# EAGLE design pcb_5 (EAGLE 5.06)
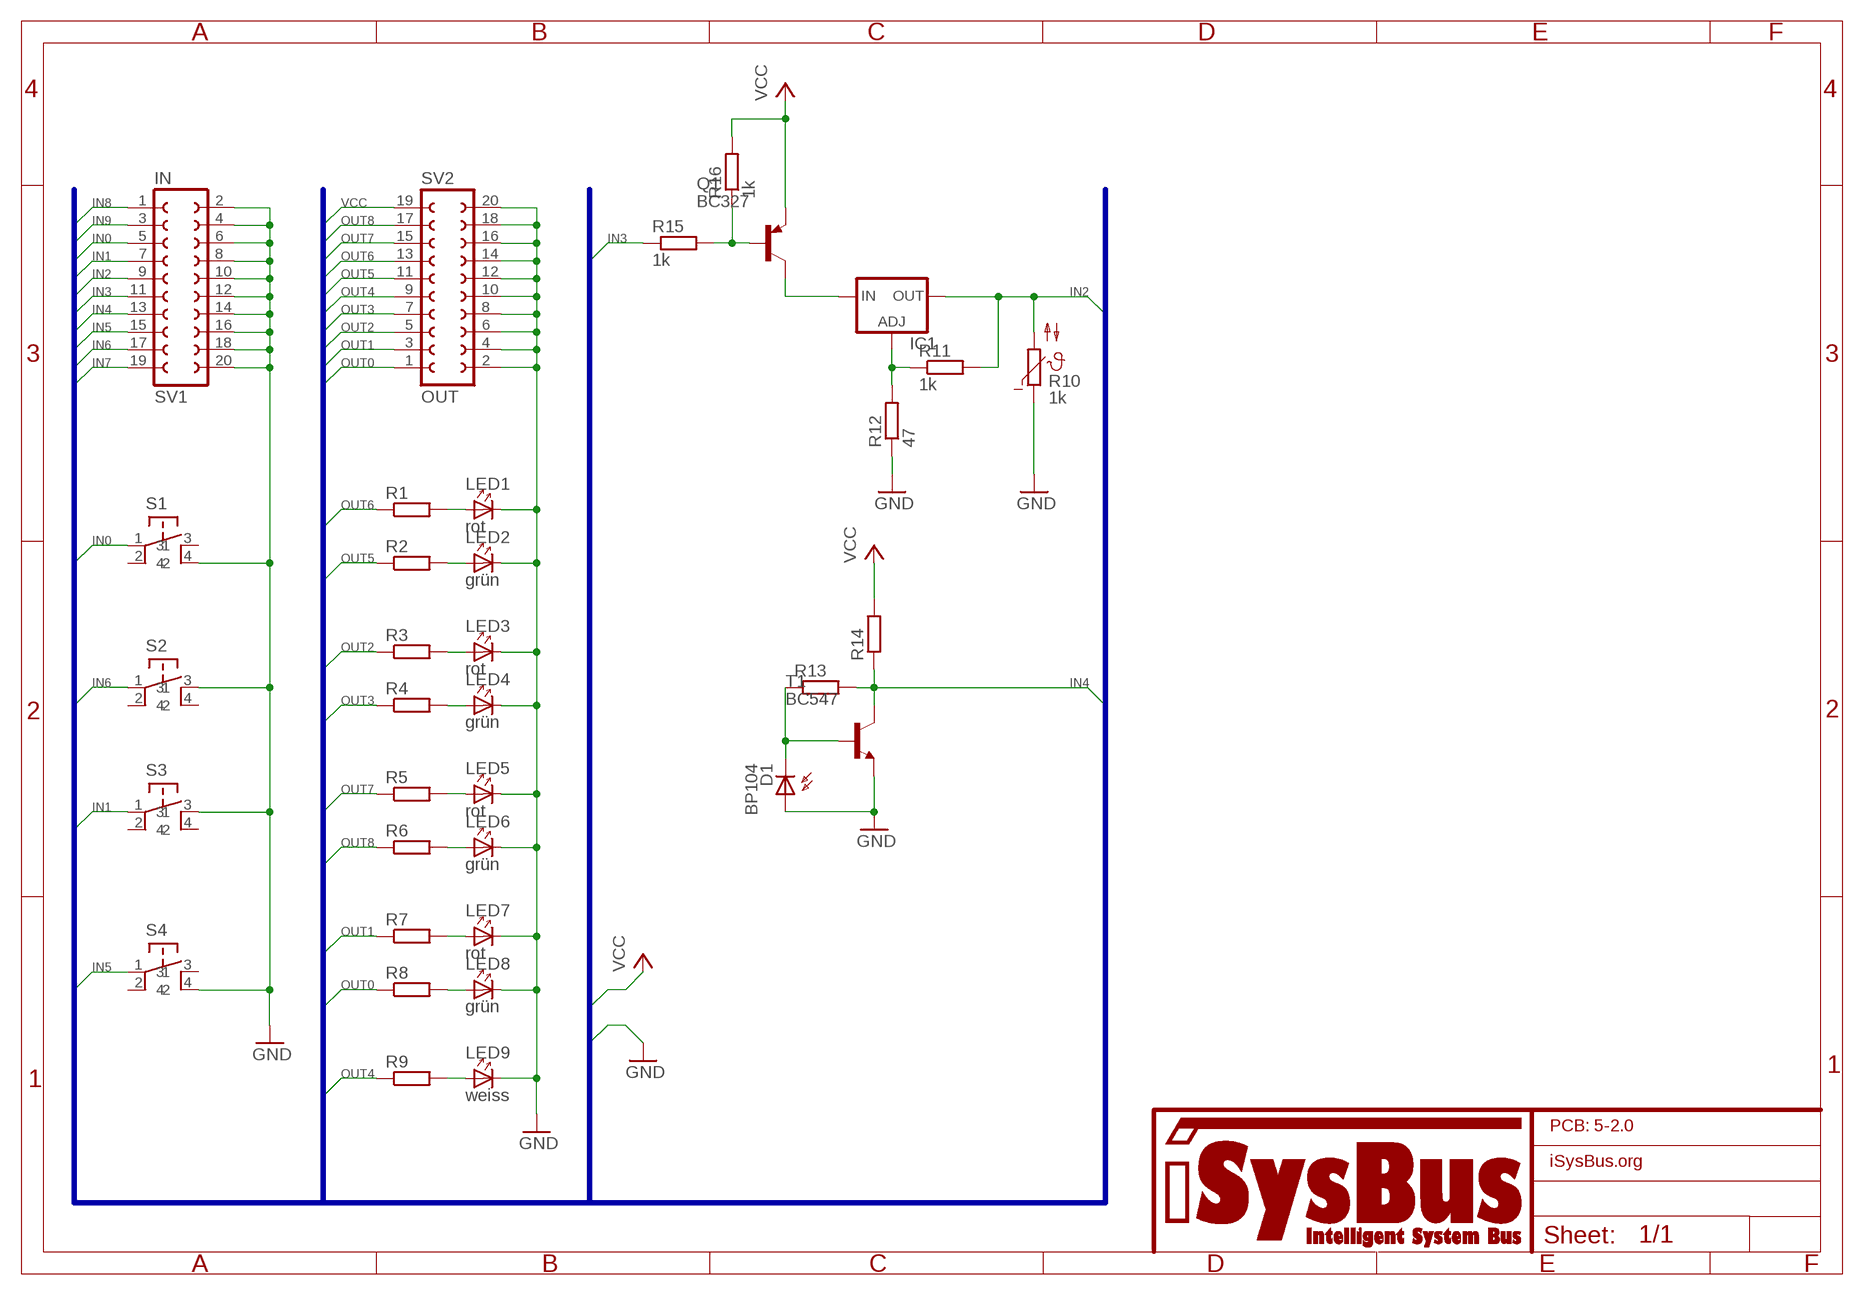
[diagram p0: schematic, sheet 1]

## Parts
D1  BP104  [BP104]
IC1  LM317L  [317L]
LED1  rot  LED_PLCC2-PLCC3528  [PLCC2-PLCC3528]
LED2  grün  LED_PLCC2-PLCC3528  [PLCC2-PLCC3528]
LED3  rot  LED_PLCC2-PLCC3528  [PLCC2-PLCC3528]
LED4  grün  LED_PLCC2-PLCC3528  [PLCC2-PLCC3528]
LED5  rot  LED_PLCC2-PLCC3528  [PLCC2-PLCC3528]
LED6  grün  LED_PLCC2-PLCC3528  [PLCC2-PLCC3528]
LED7  rot  LED_PLCC2-PLCC3528  [PLCC2-PLCC3528]
LED8  grün  LED_PLCC2-PLCC3528  [PLCC2-PLCC3528]
LED9  weiss  LED_PLCC2-PLCC3528  [PLCC2-PLCC3528]
Q1  BC327  [TO92]
R1  R-R0805  [R0805]
R2  R-R0805  [R0805]
R3  R-R0805  [R0805]
R4  R-R0805  [R0805]
R5  R-R0805  [R0805]
R6  R-R0805  [R0805]
R7  R-R0805  [R0805]
R8  R-R0805  [R0805]
R9  R-R0805  [R0805]
R10  1k  NTC640  [P640]
R11  1k  R-R0805  [R0805]
R12  47  R-R0805  [R0805]
R13  R-R0805  [R0805]
R14  R-R0805  [R0805]
R15  1k  R-R0805  [R0805]
R16  1k  R-R0805  [R0805]
S1  LSH1301  [LSH1301]
S2  LSH1301  [LSH1301]
S3  LSH1301  [LSH1301]
S4  LSH1301  [LSH1301]
SV1  IN  FE10-2  [FE10-2]
SV2  OUT  FE10-2  [FE10-2]
T1  BC547  [TO92]
U$1  FIELD_ISB  [FIELD_ISB]
U$2  5-2.0  FIELD_PCB  [FIELD_PCB]
U$3  ISYSBUS_LOGO  [ISYSBUS_LOGO]

## Nets
GND: D1.A LED1.C LED2.C LED3.C LED4.C LED5.C LED6.C LED7.C LED8.C LED9.C R10.1 R12.1 S1.4 S2.3 S3.3 S4.4 SV1.2 SV1.4 SV1.6 SV1.8 SV1.10 SV1.12 SV1.14 SV1.16 SV1.18 SV1.20 SV2.2 SV2.4 SV2.6 SV2.8 SV2.10 SV2.12 SV2.14 SV2.16 SV2.18 SV2.20 T1.1(E)
IN0: S1.1 SV1.5
IN1: S3.1 SV1.7
IN2: IC1.2(OUT) R10.2 R11.2 SV1.9
IN3: R15.1 SV1.11
IN4: R13.2 R14.1 SV1.13 T1.3(C)
IN5: S4.1 SV1.15
IN6: S2.1 SV1.17
IN7: SV1.19
IN8: SV1.1
IN9: SV1.3
N$1: D1.K(C) R13.1 T1.2(B)
N$2: LED1.A R1.2
N$3: LED2.A R2.2
N$4: LED3.A R3.2
N$5: LED4.A R4.2
N$6: LED5.A R5.2
N$7: LED6.A R6.2
N$8: LED7.A R7.2
N$9: LED8.A R8.2
N$10: LED9.A R9.2
N$11: IC1.1(ADJ) R11.1 R12.2
N$12: Q1.2(B) R15.2 R16.1
N$13: IC1.3(IN) Q1.3(C)
OUT0: R8.1 SV2.1
OUT1: R7.1 SV2.3
OUT2: R3.1 SV2.5
OUT3: R4.1 SV2.7
OUT4: R9.1 SV2.9
OUT5: R2.1 SV2.11
OUT6: R1.1 SV2.13
OUT7: R5.1 SV2.15
OUT8: R6.1 SV2.17
VCC: Q1.1(E) R14.2 R16.2 SV2.19
Unconnected: S1.2 S1.3 S2.2 S2.4 S3.2 S3.4 S4.2 S4.3

## Buses
IN[0..9],VCC,GND
OUT[0..8],VCC,GND

## Library data of the parts
D1 = opto-trans-siemens:BP104: PHOTO DIODE
IC1 = v-reg:LM317L: VOLTAGE REGULATOR
LED1-LED9 = isysbus_active:LED_PLCC2-PLCC3528
Q1 = transistor-pnp:BC327: PNP Transistor
R1-R9 R11-R16 = isb_resistors:R: RESISTOR, European symbol
R10 = ptc-ntc:NTC640: PHILIPS NTC
S1-S4 = isb_buttons:LSH1301
SV1 SV2 = con-lsta:FE10-2: FEMALE HEADER
T1 = transistor:BC547: NPN TRANSISTOR
U$1 = isb_misc:FIELD_ISB
U$2 = isb_misc:FIELD_PCB
U$3 = isysbus_misc:ISYSBUS_LOGO: iSysBus Logo

## Board
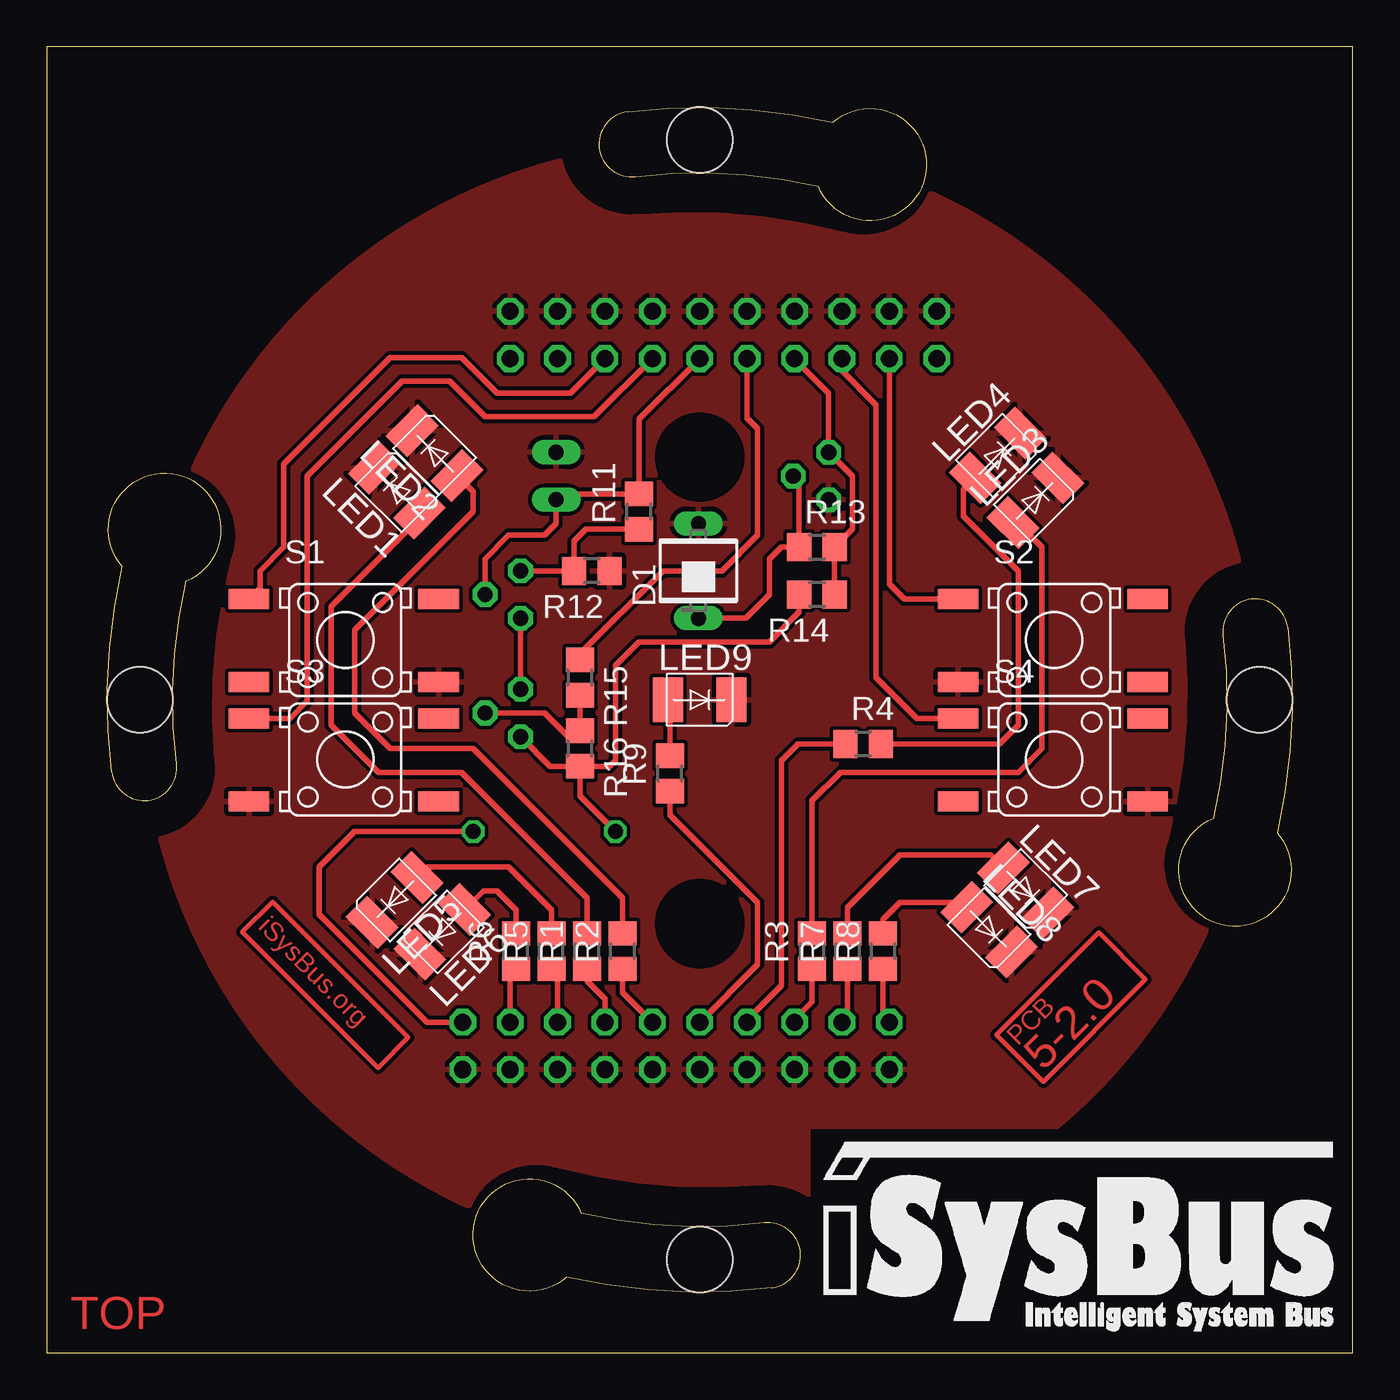
[diagram p1: board, top side]
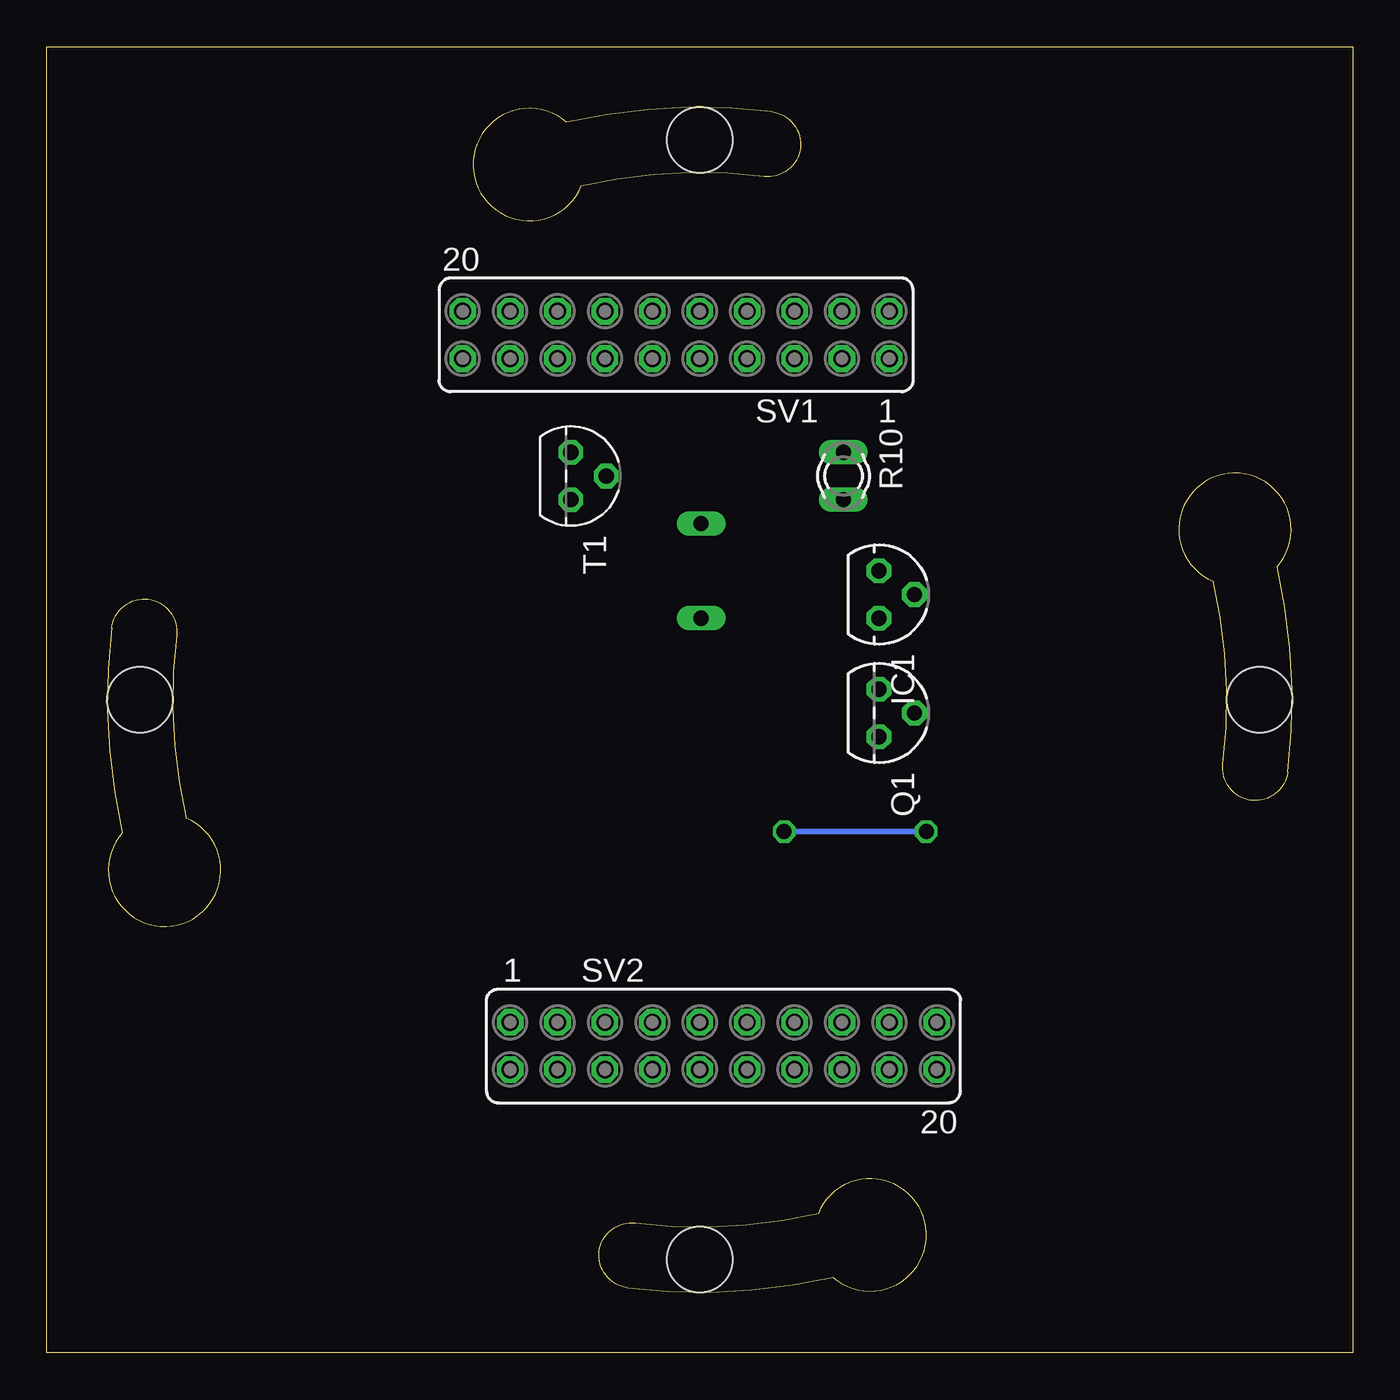
[diagram p2: board, bottom side, seen from below]

Size 70 x 70 mm. Coordinates in mm from the lower left corner, seen from the top.
Outline: 0,0 70,0 70,70 0,70 0,0
Copper layers (1*16): Top 0.035mm / dielectric 1.5mm / Bottom 0.035mm
Design rules "default": minimum track width 10mil, minimum drill 24mil, track to track 8mil, track to pad 8mil, pad to pad 8mil, via to via 8mil, smd to smd 8mil, copper to edge 40mil, drill to drill 8mil, minimum pad ring 10mil, minimum via ring 8mil, stop-mask expansion 4mil, vias tented up to drill 0mil, thermal gap 10mil
Holes 3.5 mm at 35,5 35,65 5,35 65,35
tRestrict: area 32.8,20.8 to 37.2,25.2; area 32.8,45.8 to 37.2,50.2; area 5,5 to 65,65; 16 lines
Milling: 16 lines

### Footprints (pad centres in the part's own frame; a part is rotated, then mirrored left to right if it is on the bottom)
BP104 = drill 0.813 long: A 0,2.54; K 0,-2.54
317L = drill 0.813 octagon: 1 -1.27,0; 2 0,1.905; 3 1.27,0
PLCC2-PLCC3528 = smd 1.6 x 2.4: A -1.7,0; C 1.7,0
TO92 = drill 0.813 octagon: 1 1.27,0; 2 0,1.905; 3 -1.27,0
R0805 = smd 1.3 x 1.5: 1 -0.95,0; 2 0.95,0
P640 = drill 0.813 long: 1 -1.27,0; 2 1.27,0
LSH1301 = smd 2.184 x 1.067: 1 -5.155,2.195; 2 5.005,2.195; 3 -5.155,-2.25; 4 5.005,-2.25
FE10-2 = drill 0.914 octagon: 1 -11.43,1.27; 2 -11.43,-1.27; 3 -8.89,1.27; 4 -8.89,-1.27; 5 -6.35,1.27; 6 -6.35,-1.27; 7 -3.81,1.27; 8 -3.81,-1.27; 9 -1.27,1.27; 10 -1.27,-1.27; 11 1.27,1.27; 12 1.27,-1.27; 13 3.81,1.27; 14 3.81,-1.27; 15 6.35,1.27; 16 6.35,-1.27; 17 8.89,1.27; 18 8.89,-1.27; 19 11.43,1.27; 20 11.43,-1.27

### Placement (x,y rotation side)
D1  34.92,41.91 0 top
IC1  25.4,40.64 270 bottom
LED1  18.77,46.21 135 top
LED2  20.79,48.22 135 top
LED3  52.98,45.7 45 top
LED4  50.97,48.09 45 top
LED5  18.65,24.27 225 top
LED6  21.2,22.56 225 top
LED7  52.47,24.79 315 top
LED8  50.5,22.68 315 top
LED9  35,35 0 top
Q1  25.4,34.29 270 bottom
R1  28.95,21.53 90 top
R2  30.86,21.53 90 top
R3  41.02,21.53 90 top
R4  43.76,32.64 0 top
R5  27.05,21.53 90 top
R6  25.14,21.53 90 top
R7  42.92,21.53 90 top
R8  44.83,21.53 90 top
R9  33.4,31.05 90 top
R10  27.3,46.99 270 bottom
R11  31.75,45.09 90 top
R12  29.21,41.91 180 top
R13  41.27,43.18 0 top
R14  41.27,40.64 180 top
R15  28.57,36.2 270 top
R16  28.57,32.38 270 top
S1  16,38.2 0 top
S2  54,38.2 0 top
S3  16,31.8 0 top
S4  54,31.8 0 top
SV1  36.27,54.55 180 bottom
SV2  33.73,16.45 0 bottom
T1  41.91,46.99 270 bottom
U$1  10.13,21.66 315 top
U$2  53.41,15.07 45 top
U$3  41.61,1.17 0 top

### Tracks (layer width: path | path; a pad name or v marks a point on that pad's centre or on a via)
GND
  pour Top: 1.27,68.58 68.58,68.58 68.58,1.27 1.27,1.27
IN0
  Top 0.305: SV1.5 28.07,51.44 24.13,51.44 22.23,53.34 18.41,53.34 12.7,47.62 12.7,43.18 11.43,41.91 11.43,40.98 S1.1
IN1
  Top 0.305: SV1.7 29.34,50.16 23.5,50.16 21.59,52.07 19.05,52.07 13.97,46.99 13.97,34.92 13.04,33.99 S3.1
IN2
  Top 0.305: IC1.2 23.5,42.55 24.77,43.81 26.67,43.81 27.3,44.45 R10.2 27.62,46.03 R11.2 31.75,50.03 SV1.9
IN3
  Top 0.305: SV1.11 37.54,50.09 38.1,49.53 38.1,48.26 38.1,46.99 38.1,43.81 36.2,41.91 33.02,41.91 28.57,37.47 R15.1
IN4
  Top 0.305: SV1.13 40.08,53.27 41.91,51.44 T1.3 43.18,46.99 43.18,44.13 R13.2 R14.1
IN5
  Top 0.305: SV1.15 42.62,52.63 44.45,50.8 44.45,36.2 46.65,33.99 S4.1
IN6
  Top 0.305: S2.1 45.97,40.4 45.16,41.2 SV1.17
N$1
  Top 0.305: D1.K 37.47,39.37 38.73,40.64 38.73,42.55 39.37,43.18 R13.1 40.33,46.67 T1.2
N$2
  Top 0.305: R1.2 28.95,24.39 22.23,31.11 17.78,31.11 15.24,33.66 15.24,40.01 19.68,44.45 19.68,44.72 LED1.A
N$3
  Top 0.305: LED2.A 22.86,46.15 22.86,45.09 16.51,38.73 16.51,34.29 18.41,32.38 22.86,32.38 30.86,24.39 R2.2
N$4
  Top 0.305: LED3.A 52.03,44.49 53.34,43.18 53.34,32.38 52.07,31.11 47.62,31.11 | 47.62,31.11 46.35,31.11 | R3.2 41.02,29.59 42.55,31.11 47.62,31.11
N$5
  Top 0.305: R4.2 51.05,32.64 52.07,33.66 52.07,41.91 49.13,44.85 49.13,46.26 LED4.A
N$6
  Top 0.305: R5.2 27.05,23.75 24.77,26.04 20.41,26.04 LED5.A
N$7
  Top 0.305: R6.2 25.14,23.75 24.13,24.77 23.41,24.77 LED6.A
N$8
  Top 0.305: R7.2 42.92,23.88 45.72,26.67 50.59,26.67 LED7.A
N$9
  Top 0.305: LED8.A 49.06,24.13 45.72,24.13 44.83,23.24 R8.2
N$10
  Top 0.305: 33.4,35.1 33.48,35.18 | 33.4,35.1 LED9.A | R9.2 33.4,35.1
N$11
  Top 0.305: IC1.1 R12.2 28.26,43.5 28.89,44.13 R11.1
N$12
  Top 0.305: Q1.2 26.67,34.29 27.94,33.02 28.26,33.02 R16.1 R15.2
N$13
  Top 0.305: Q1.3 IC1.3
OUT0
  Top 0.305: R8.1 44.83,18.05 SV2.1
OUT1
  Top 0.305: R7.1 42.92,18.02 SV2.3
OUT2
  Top 0.305: SV2.5 40.08,17.86 41.02,18.8 R3.1
OUT3
  Top 0.305: SV2.7 37.54,17.86 39.37,19.68 39.37,31.75 40.26,32.64 R4.1
OUT4
  Top 0.305: SV2.9 38.1,20.82 38.1,24.13 33.4,28.83 R9.1
OUT5
  Top 0.305: R2.1 30.86,19.32 SV2.11
OUT6
  Top 0.305: SV2.13 29.92,18.98 28.95,19.94 R1.1
OUT7
  Top 0.305: SV2.15 27.38,20.25 R5.1
OUT8
  Top 0.305: SV2.17 24.84,20.27 R6.1
VCC  (via drill 0.8)
  Top 0.305: R16.2 26.98,31.43 Q1.1 | SV2.19 20.38,17.72 14.61,23.5 14.61,26.04 16.51,27.94 v22.86,27.94 | v30.48,27.94 28.57,29.84 R16.2 | R16.2 30.16,31.43 30.48,31.75 30.48,36.83 31.75,38.1 38.73,38.1 40.33,39.69 R14.2
  Bottom 0.305: v22.86,27.94 v30.48,27.94

### Text on the board
Top: TOP